# Altium schematic sheet peripherals.SchDoc
size 420 x 297 mm
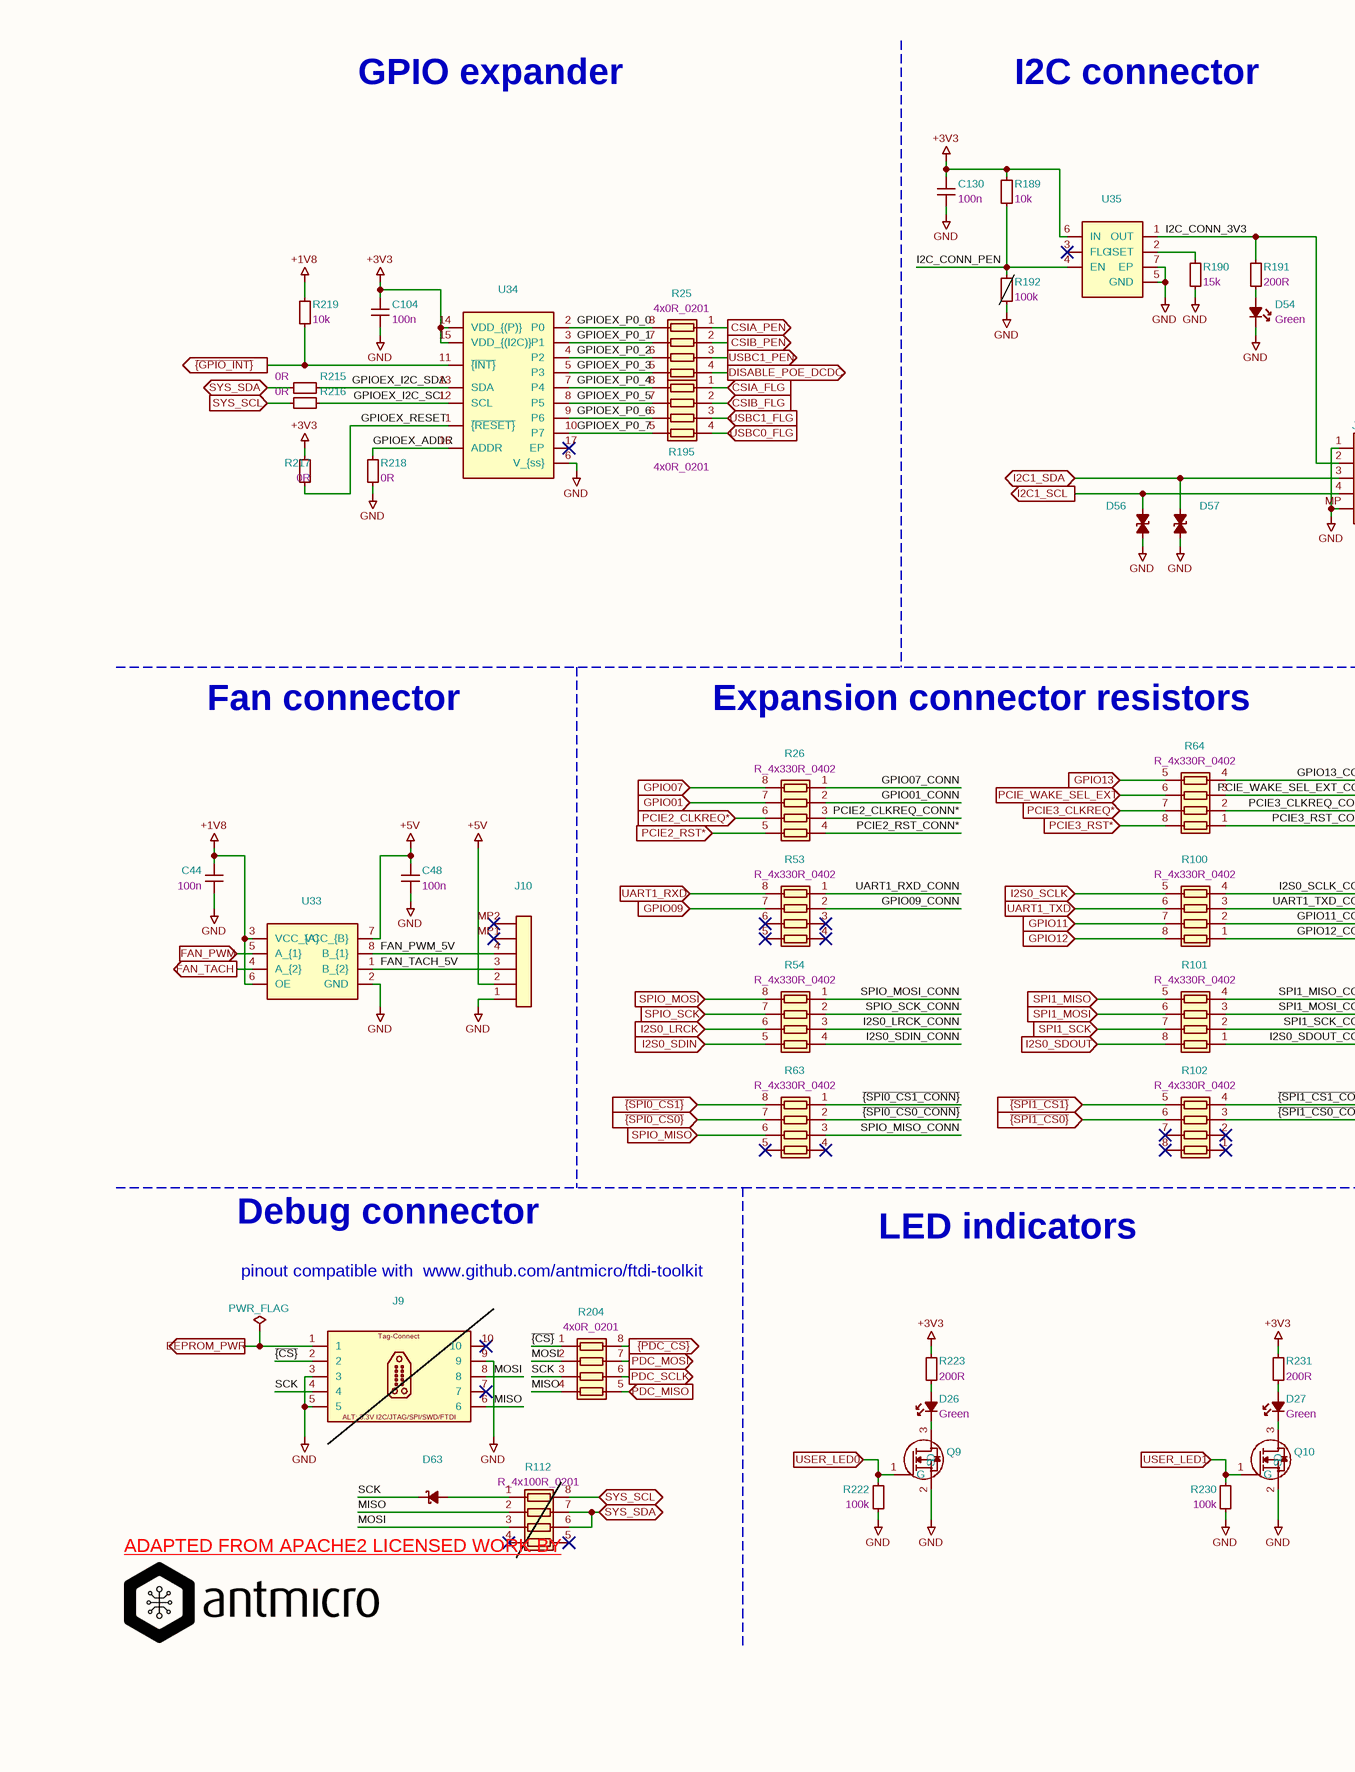
[diagram p0: peripherals.SchDoc, left]
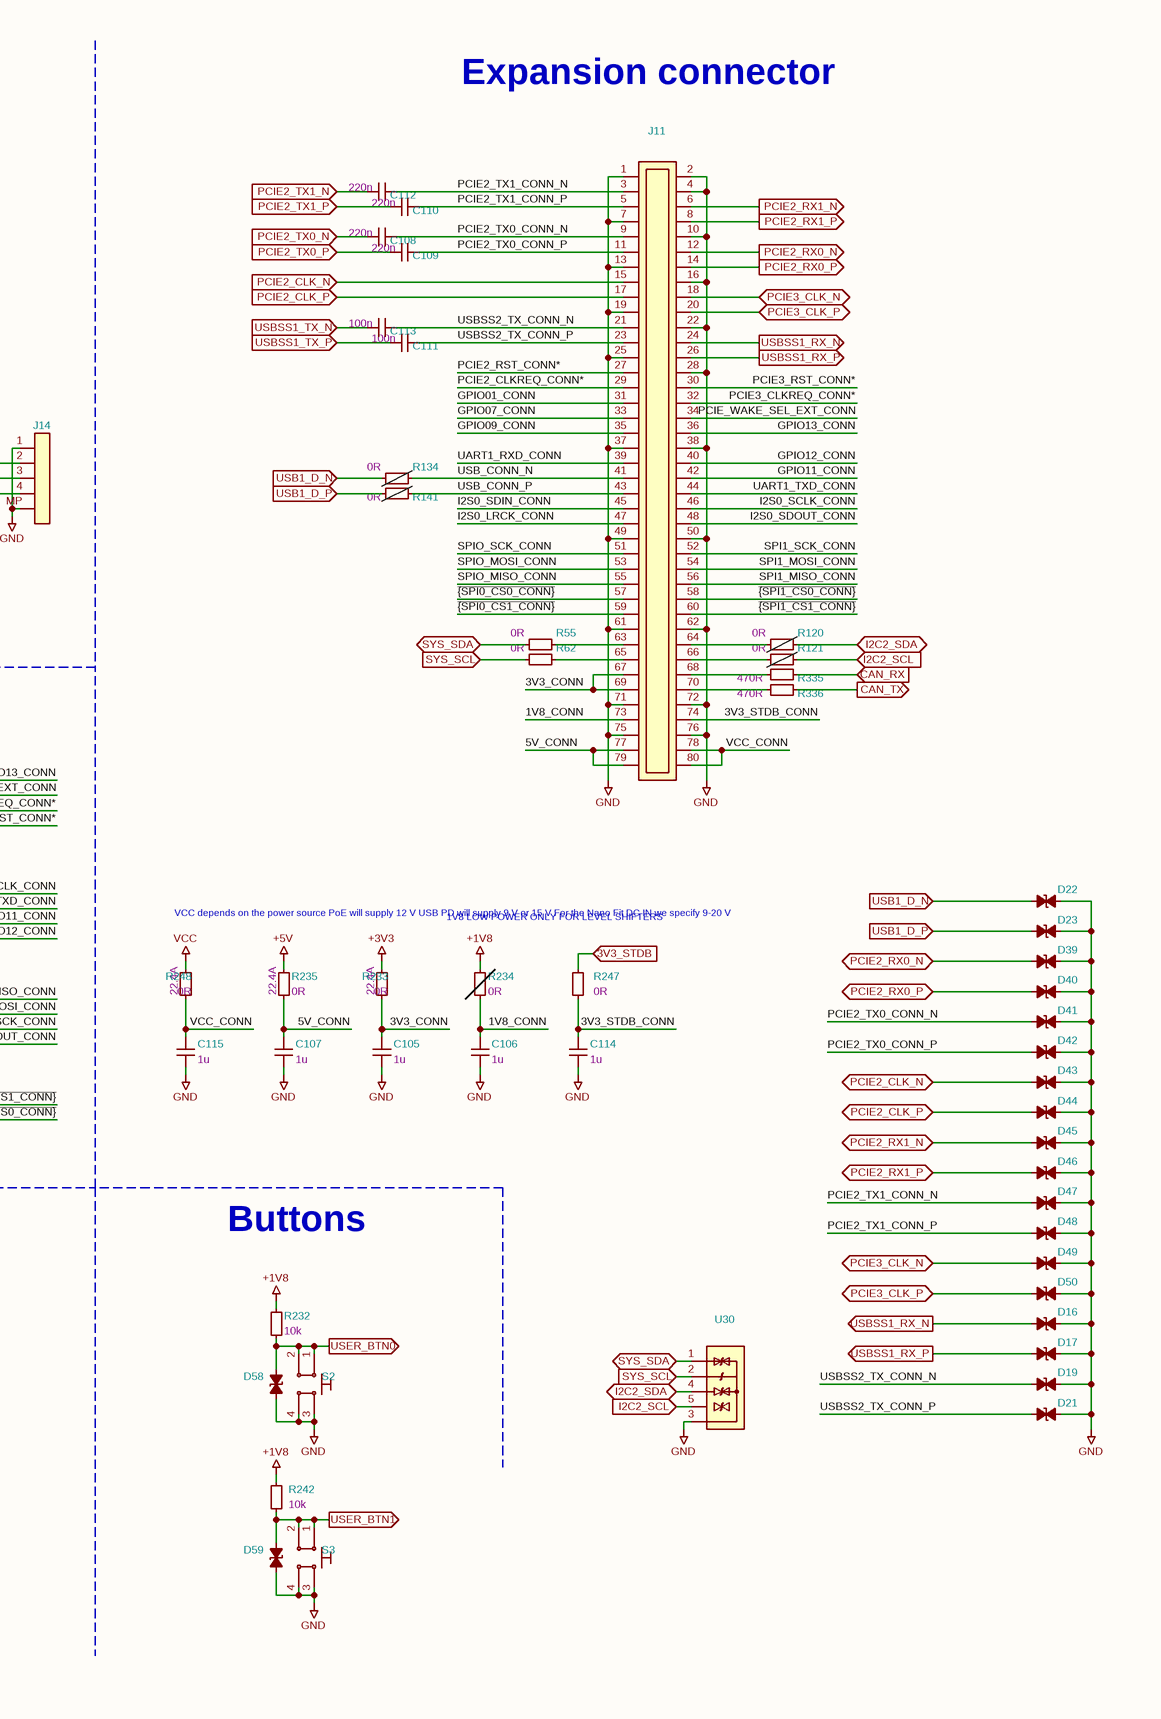
[diagram p1: peripherals.SchDoc, right]

## Parts
#FLG07  PWR_FLAG  (graphical)
C44  Val: 100n  [C_0402_1005Metric]  (hidden comment: GRM155R61H104KE14D)
C48  Val: 100n  [C_0402_1005Metric]  (hidden comment: GRM155R61H104KE14D)
C104  Val: 100n  [C_0402_1005Metric]  (hidden comment: GRM155R61H104KE14D)
C105  Val: 1u  [C_0402_1005Metric]  (hidden comment: C1005X6S1A105K050BC)
C106  Val: 1u  [C_0402_1005Metric]  (hidden comment: C1005X6S1A105K050BC)
C107  Val: 1u  [C_0402_1005Metric]  (hidden comment: C1005X6S1A105K050BC)
C108  Val: 220n  [C_0402_1005Metric]  (hidden comment: CC0402KRX5R6BB224)
C109  Val: 220n  [C_0402_1005Metric]  (hidden comment: CC0402KRX5R6BB224)
C110  Val: 220n  [C_0402_1005Metric]  (hidden comment: CC0402KRX5R6BB224)
C111  Val: 100n  [C_0402_1005Metric]  (hidden comment: GRM155R61H104KE14D)
C112  Val: 220n  [C_0402_1005Metric]  (hidden comment: CC0402KRX5R6BB224)
C113  Val: 100n  [C_0402_1005Metric]  (hidden comment: GRM155R61H104KE14D)
C114  Val: 1u  [C_0402_1005Metric]  (hidden comment: C1005X6S1A105K050BC)
C115  Val: 1u  [C_0402_1005Metric]  (hidden comment: C1005X6S1A105K050BC)
C130  Val: 100n  [C_0402_1005Metric]  (hidden comment: GRM155R61H104KE14D)
D16  TPD1E0B04DPYR  [XDFN-2_1x0.60mm]  (value not drawn)
D17  TPD1E0B04DPYR  [XDFN-2_1x0.60mm]  (value not drawn)
D19  TPD1E0B04DPYR  [XDFN-2_1x0.60mm]  (value not drawn)
D21  TPD1E0B04DPYR  [XDFN-2_1x0.60mm]  (value not drawn)
D22  TPD1E0B04DPYR  [XDFN-2_1x0.60mm]  (value not drawn)
D23  TPD1E0B04DPYR  [XDFN-2_1x0.60mm]  (value not drawn)
D26  Color: Green  [LED_0603_1608Metric_G]  (hidden comment: LTST-C190GKT)
D27  Color: Green  [LED_0603_1608Metric_G]  (hidden comment: LTST-C190GKT)
D39  TPD1E0B04DPYR  [XDFN-2_1x0.60mm]  (value not drawn)
D40  TPD1E0B04DPYR  [XDFN-2_1x0.60mm]  (value not drawn)
D41  TPD1E0B04DPYR  [XDFN-2_1x0.60mm]  (value not drawn)
D42  TPD1E0B04DPYR  [XDFN-2_1x0.60mm]  (value not drawn)
D43  TPD1E0B04DPYR  [XDFN-2_1x0.60mm]  (value not drawn)
D44  TPD1E0B04DPYR  [XDFN-2_1x0.60mm]  (value not drawn)
D45  TPD1E0B04DPYR  [XDFN-2_1x0.60mm]  (value not drawn)
D46  TPD1E0B04DPYR  [XDFN-2_1x0.60mm]  (value not drawn)
D47  TPD1E0B04DPYR  [XDFN-2_1x0.60mm]  (value not drawn)
D48  TPD1E0B04DPYR  [XDFN-2_1x0.60mm]  (value not drawn)
D49  TPD1E0B04DPYR  [XDFN-2_1x0.60mm]  (value not drawn)
D50  TPD1E0B04DPYR  [XDFN-2_1x0.60mm]  (value not drawn)
D54  Color: Green  [LED_0603_1608Metric_G]  (hidden comment: LTST-C190GKT)
D56  TPD1E0B04DPYR  [XDFN-2_1x0.60mm]  (value not drawn)
D57  TPD1E0B04DPYR  [XDFN-2_1x0.60mm]  (value not drawn)
D58  TPD1E0B04DPYR  [XDFN-2_1x0.60mm]  (value not drawn)
D59  TPD1E0B04DPYR  [XDFN-2_1x0.60mm]  (value not drawn)
D63  RB521S30T1G  [SOD-523]  (value not drawn)
J9  TC2050-IDC-NL  [Tag-Connect_TC2050-IDC-NL_2x5_P1.27mm]  (value not drawn)  (no BOM)
J10  0533980471  [Conn_Molex_PicoBlade_1x4_0533980471]  (value not drawn)
J11  ERF8-040-05.0-L-DV-K-TR  [Conn_Socket_Samtec_ERF8_2x40_ERF8-040-05.0-L-DV-K-TR]  (value not drawn)
J14  SM04B-SRSS-TB(LF)(SN)  [Conn_JST_SH_1x4_SM04B-SRSS-TB-LF-SN]  (value not drawn)
Q9  PJE138K_R1_00001  [SOT-523]  (value not drawn)
Q10  PJE138K_R1_00001  [SOT-523]  (value not drawn)
R25  Val: 4x0R_0201  [R_Array_4x0201_Panasonic_EXB18V]  (hidden comment: EXB-18VR000X)
R26  Val: R_4x330R_0402  [R_Array_4x0402]  (hidden comment: EXB-28V331JX)
R53  Val: R_4x330R_0402  [R_Array_4x0402]  (hidden comment: EXB-28V331JX)
R54  Val: R_4x330R_0402  [R_Array_4x0402]  (hidden comment: EXB-28V331JX)
R55  Val: 0R  [R_0402_1005Metric]  (hidden comment: ERJ2GE0R00X)
R62  Val: 0R  [R_0402_1005Metric]  (hidden comment: ERJ2GE0R00X)
R63  Val: R_4x330R_0402  [R_Array_4x0402]  (hidden comment: EXB-28V331JX)
R64  Val: R_4x330R_0402  [R_Array_4x0402]  (hidden comment: EXB-28V331JX)
R100  Val: R_4x330R_0402  [R_Array_4x0402]  (hidden comment: EXB-28V331JX)
R101  Val: R_4x330R_0402  [R_Array_4x0402]  (hidden comment: EXB-28V331JX)
R102  Val: R_4x330R_0402  [R_Array_4x0402]  (hidden comment: EXB-28V331JX)
R112  Val: R_4x100R_0201  [R_Array_4x0201_Panasonic_EXB18V]  (hidden comment: EXB-18V101JX)  (no BOM)
R120  Val: 0R  [R_0402_1005Metric]  (hidden comment: ERJ2GE0R00X)  (no BOM)
R121  Val: 0R  [R_0402_1005Metric]  (hidden comment: ERJ2GE0R00X)  (no BOM)
R134  Val: 0R  [R_0402_1005Metric]  (hidden comment: ERJ2GE0R00X)  (no BOM)
R141  Val: 0R  [R_0402_1005Metric]  (hidden comment: ERJ2GE0R00X)  (no BOM)
R189  Val: 10k  [R_0402_1005Metric]  (hidden comment: CR0402-FX-1002GLF)
R190  Val: 15k  [R_0402_1005Metric]  (hidden comment: CR0402-FX-1502GLF)
R191  Val: 200R  [R_0402_1005Metric]  (hidden comment: CR0402-FX-2000GLF)
R192  Val: 100k  [R_0402_1005Metric]  (hidden comment: CR0402-FX-1003GLF)  (no BOM)
R195  Val: 4x0R_0201  [R_Array_4x0201_Panasonic_EXB18V]  (hidden comment: EXB-18VR000X)
R204  Val: 4x0R_0201  [R_Array_4x0201_Panasonic_EXB18V]  (hidden comment: EXB-18VR000X)
R215  Val: 0R  [R_0402_1005Metric]  (hidden comment: ERJ2GE0R00X)
R216  Val: 0R  [R_0402_1005Metric]  (hidden comment: ERJ2GE0R00X)
R217  Val: 0R  [R_0402_1005Metric]  (hidden comment: ERJ2GE0R00X)
R218  Val: 0R  [R_0402_1005Metric]  (hidden comment: ERJ2GE0R00X)
R219  Val: 10k  [R_0402_1005Metric]  (hidden comment: CR0402-FX-1002GLF)
R222  Val: 100k  [R_0402_1005Metric]  (hidden comment: CR0402-FX-1003GLF)
R223  Val: 200R  [R_0402_1005Metric]  (hidden comment: CR0402-FX-2000GLF)
R230  Val: 100k  [R_0402_1005Metric]  (hidden comment: CR0402-FX-1003GLF)
R231  Val: 200R  [R_0402_1005Metric]  (hidden comment: CR0402-FX-2000GLF)
R232  Val: 10k  [R_0402_1005Metric]  (hidden comment: CR0402-FX-1002GLF)
R233  Val: 0R  Max. Curr.: 22.4A  [R_0603_1608Metric]  (hidden comment: PMR03EZPJ000)
R234  Val: 0R  [R_0603_1608Metric]  (hidden comment: CR0603-J/-000ELF)  (no BOM)
R235  Val: 0R  Max. Curr.: 22.4A  [R_0603_1608Metric]  (hidden comment: PMR03EZPJ000)
R242  Val: 10k  [R_0402_1005Metric]  (hidden comment: CR0402-FX-1002GLF)
R247  Val: 0R  [R_0603_1608Metric]  (hidden comment: CR0603-J/-000ELF)
R248  Val: 0R  Max. Curr.: 22.4A  [R_0603_1608Metric]  (hidden comment: PMR03EZPJ000)
R335  Val: 470R  [R_0402_1005Metric]  (hidden comment: CR0402-FX-4700GLF)
R336  Val: 470R  [R_0402_1005Metric]  (hidden comment: CR0402-FX-4700GLF)
S2  KMR211NGLFS  [SW_KMR211NGLFS_SMD]  (value not drawn)
S3  KMR211NGLFS  [SW_KMR211NGLFS_SMD]  (value not drawn)
U30  TPD4E05U06QDQARQ1  [USON-10_2.5x1mm_P0.5mm]  (value not drawn)
U33  NTS0102GT  [XSON-8_1x1.95mm_P0.5mm]  (value not drawn)
U34  PCAL6408ABSHP  [VQFN-16-1EP_3x3mm_P0.5mm_EP1.68x1.68mm]  (value not drawn)
U35  AP22653FDZ-7  [DFN-6-1EP_2x2mm_P0.65mm_EP1x1.6mm]  (value not drawn)

## Ports
3V3_STDB (in), CAN_RX (in), CAN_TX (out), CSIA_FLG (in), CSIA_PEN (out), CSIB_FLG (in), CSIB_PEN (out), DISABLE_POE_DCDC (out), EEPROM_PWR (out), FAN_PWM (in), FAN_TACH (out), GPIO01 (in), GPIO07 (in), GPIO09 (in), GPIO11 (in), GPIO12 (in), GPIO13 (in), I2C1_SCL (out), I2C1_SDA (bidir), I2C2_SCL (in), I2C2_SDA (bidir), I2S0_LRCK (in), I2S0_SCLK (in), I2S0_SDIN (in), I2S0_SDOUT (in), PCIE2_CLK_N (bidir), PCIE2_CLK_N (in), PCIE2_CLK_P (bidir), PCIE2_CLK_P (in), PCIE2_CLKREQ* (in), PCIE2_RST* (in), PCIE2_RX0_N (bidir), PCIE2_RX0_N (out), PCIE2_RX0_P (bidir), PCIE2_RX0_P (out), PCIE2_RX1_N (bidir), PCIE2_RX1_N (out), PCIE2_RX1_P (bidir), PCIE2_RX1_P (out), PCIE2_TX0_N (in), PCIE2_TX0_P (in), PCIE2_TX1_N (in), PCIE2_TX1_P (in), PCIE3_CLK_N (bidir), PCIE3_CLK_P (bidir), PCIE3_CLKREQ* (in), PCIE3_RST* (in), PCIE_WAKE_SEL_EXT (in), PDC_MISO (in), PDC_MOSI (out), PDC_SCLK (out), SPI1_MISO (in), SPI1_MOSI (in), SPI1_SCK (in), SPIO_MISO (in), SPIO_MOSI (in), SPIO_SCK (in), SYS_SCL (bidir), SYS_SCL (in), SYS_SDA (bidir), UART1_RXD (in), UART1_TXD (in), USB1_D_N (in), USB1_D_P (in), USBC0_FLG (in), USBC1_FLG (in), USBC1_PEN (out), USBSS1_RX_N (out), USBSS1_RX_P (out), USBSS1_TX_N (in), USBSS1_TX_P (in), USER_BTN0 (out), USER_BTN1 (out), USER_LED0 (in), USER_LED1 (in), ~{{GPIO_INT}} (out), ~{{PDC_CS}} (out), ~{{SPI0_CS0}} (in), ~{{SPI0_CS1}} (in), ~{{SPI1_CS0}} (in), ~{{SPI1_CS1}} (in)

## Nets
+1V8: C44.2 R219.2 R232.2 R234.1 R242.2 U33.3(VCC_{A}) U33.6(OE)
+3V3: C104.2 C130.1 R189.2 R217.1 R223.2 R231.2 R233.1 U34.14(VDD_{(P)}) U34.15(VDD_{(I2C)}) U35.6(IN)
+5V: C48.2 J10.2 R235.2 U33.7(VCC_{B})
GND: C44.1 C48.1 C104.1 C105.1 C106.1 C107.1 C114.2 C115.2 C130.2 D16.2(A) D17.2(A) D19.2(A) D21.2(A) D22.2(A) D23.2(A) D39.2(A) D40.2(A) D41.2(A) D42.2(A) D43.2(A) D44.2(A) D45.2(A) D46.2(A) D47.2(A) D48.2(A) D49.2(A) D50.2(A) D54.1(C) D56.1(C) D57.1(C) D58.1(C) D59.1(C) J9.3 J9.5 J9.9 J10.1 J11.1 J11.2 J11.4 J11.7 J11.10 J11.13 J11.16 J11.19 J11.22 J11.25 J11.28 J11.37 J11.38 J11.49 J11.50 J11.61 J11.62 J11.71 J11.72 J11.75 J11.76 J14.1 J14.MP Q9.2(S) Q10.2(S) R190.1 R192.1 R218.1 R222.1 R230.1 S2.3 S2.4 S3.3 S3.4 U30.3 U33.2(GND) U34.6(V_{ss}) U35.5(GND) U35.7(EP)
VCC: R248.1
1V8_CONN: C106.2 J11.73 R234.2
3V3_CONN: C105.2 J11.67 J11.69 R233.2
3V3_STDB: R247.2 ; port 3V3_STDB
3V3_STDB_CONN: C114.1 J11.74 R247.1
5V_CONN: C107.2 J11.77 J11.79 R235.1
CAN_RX: R335.1 ; port CAN_RX
CAN_TX: R336.1 ; port CAN_TX
CSIA_FLG: R195.1(R1.1) ; port CSIA_FLG
CSIA_PEN: R25.1(R1.1) ; port CSIA_PEN
CSIB_FLG: R195.2(R2.1) ; port CSIB_FLG
CSIB_PEN: R25.2(R2.1) ; port CSIB_PEN
DISABLE_POE_DCDC: R25.4(R4.1) ; port DISABLE_POE_DCDC
EEPROM_PWR: #FLG07.1(pwr) J9.1 ; port EEPROM_PWR
FAN_PWM: U33.5(A_{1}) ; port FAN_PWM
FAN_PWM_5V: J10.4 U33.8(B_{1})
FAN_TACH: U33.4(A_{2}) ; port FAN_TACH
FAN_TACH_5V: J10.3 U33.1(B_{2})
GPIO01: R26.7(R2.2) ; port GPIO01
GPIO01_CONN: J11.31 R26.2(R2.1)
GPIO07: R26.8(R1.2) ; port GPIO07
GPIO07_CONN: J11.33 R26.1(R1.1)
GPIO09: R53.7(R2.2) ; port GPIO09
GPIO09_CONN: J11.35 R53.2(R2.1)
GPIO11: R100.7(R2.2) ; port GPIO11
GPIO11_CONN: J11.42 R100.2(R2.1)
GPIO12: R100.8(R1.2) ; port GPIO12
GPIO12_CONN: J11.40 R100.1(R1.1)
GPIO13: R64.5(R4.2) ; port GPIO13
GPIO13_CONN: J11.36 R64.4(R4.1)
GPIOEX_ADDR: R218.2 U34.16(ADDR)
GPIOEX_I2C_SCL: R216.2 U34.12(SCL)
GPIOEX_I2C_SDA: R215.2 U34.13(SDA)
GPIOEX_P0_0: R25.8(R1.2) U34.2(P0)
GPIOEX_P0_1: R25.7(R2.2) U34.3(P1)
GPIOEX_P0_2: R25.6(R3.2) U34.4(P2)
GPIOEX_P0_3: R25.5(R4.2) U34.5(P3)
GPIOEX_P0_4: R195.8(R1.2) U34.7(P4)
GPIOEX_P0_5: R195.7(R2.2) U34.8(P5)
GPIOEX_P0_6: R195.6(R3.2) U34.9(P6)
GPIOEX_P0_7: R195.5(R4.2) U34.10(P7)
GPIOEX_RESET: R217.2 U34.1(~{{RESET}})
I2C1_SCL: D56.2(A) J14.4 ; port I2C1_SCL
I2C1_SDA: D57.2(A) J14.3 ; port I2C1_SDA
I2C2_SCL: R121.2 U30.5 ; port I2C2_SCL
I2C2_SDA: R120.2 U30.4 ; port I2C2_SDA
I2C_CONN_3V3: J14.2 R191.2 U35.1(OUT)
I2C_CONN_PEN: R189.1 R192.2 U35.4(EN)
I2S0_LRCK: R54.6(R3.2) ; port I2S0_LRCK
I2S0_LRCK_CONN: J11.47 R54.3(R3.1)
I2S0_SCLK: R100.5(R4.2) ; port I2S0_SCLK
I2S0_SCLK_CONN: J11.46 R100.4(R4.1)
I2S0_SDIN: R54.5(R4.2) ; port I2S0_SDIN
I2S0_SDIN_CONN: J11.45 R54.4(R4.1)
I2S0_SDOUT: R101.8(R1.2) ; port I2S0_SDOUT
I2S0_SDOUT_CONN: J11.48 R101.1(R1.1)
MISO: J9.6 R112.2(R2.1) R204.4(R4.1)
MOSI: J9.8 R112.3(R3.1) R204.2(R2.1)
PCIE2_CLK_N: D43.1(C) J11.15 ; port PCIE2_CLK_N
PCIE2_CLK_P: D44.1(C) J11.17 ; port PCIE2_CLK_P
PCIE2_CLKREQ*: R26.6(R3.2) ; port PCIE2_CLKREQ*
PCIE2_CLKREQ_CONN*: J11.29 R26.3(R3.1)
PCIE2_RST*: R26.5(R4.2) ; port PCIE2_RST*
PCIE2_RST_CONN*: J11.27 R26.4(R4.1)
PCIE2_RX0_N: D39.1(C) J11.12 ; port PCIE2_RX0_N
PCIE2_RX0_P: D40.1(C) J11.14 ; port PCIE2_RX0_P
PCIE2_RX1_N: D45.1(C) J11.6 ; port PCIE2_RX1_N
PCIE2_RX1_P: D46.1(C) J11.8 ; port PCIE2_RX1_P
PCIE2_TX0_CONN_N: C108.1 D41.1(C) J11.9
PCIE2_TX0_CONN_P: C109.1 D42.1(C) J11.11
PCIE2_TX0_N: C108.2 ; port PCIE2_TX0_N
PCIE2_TX0_P: C109.2 ; port PCIE2_TX0_P
PCIE2_TX1_CONN_N: C112.1 D47.1(C) J11.3
PCIE2_TX1_CONN_P: C110.1 D48.1(C) J11.5
PCIE2_TX1_N: C112.2 ; port PCIE2_TX1_N
PCIE2_TX1_P: C110.2 ; port PCIE2_TX1_P
PCIE3_CLK_N: D49.1(C) J11.18 ; port PCIE3_CLK_N
PCIE3_CLK_P: D50.1(C) J11.20 ; port PCIE3_CLK_P
PCIE3_CLKREQ*: R64.7(R2.2) ; port PCIE3_CLKREQ*
PCIE3_CLKREQ_CONN*: J11.32 R64.2(R2.1)
PCIE3_RST*: R64.8(R1.2) ; port PCIE3_RST*
PCIE3_RST_CONN*: J11.30 R64.1(R1.1)
PCIE_WAKE_SEL_EXT: R64.6(R3.2) ; port PCIE_WAKE_SEL_EXT
PCIE_WAKE_SEL_EXT_CONN: J11.34 R64.3(R3.1)
PDC_MISO: R204.5(R4.2) ; port PDC_MISO
PDC_MOSI: R204.7(R2.2) ; port PDC_MOSI
PDC_SCLK: R204.6(R3.2) ; port PDC_SCLK
SCK: D63.1(C) J9.4 R204.3(R3.1)
SPI1_MISO: R101.5(R4.2) ; port SPI1_MISO
SPI1_MISO_CONN: J11.56 R101.4(R4.1)
SPI1_MOSI: R101.6(R3.2) ; port SPI1_MOSI
SPI1_MOSI_CONN: J11.54 R101.3(R3.1)
SPI1_SCK: R101.7(R2.2) ; port SPI1_SCK
SPI1_SCK_CONN: J11.52 R101.2(R2.1)
SPIO_MISO: R63.6(R3.2) ; port SPIO_MISO
SPIO_MISO_CONN: J11.55 R63.3(R3.1)
SPIO_MOSI: R54.8(R1.2) ; port SPIO_MOSI
SPIO_MOSI_CONN: J11.53 R54.1(R1.1)
SPIO_SCK: R54.7(R2.2) ; port SPIO_SCK
SPIO_SCK_CONN: J11.51 R54.2(R2.1)
SYS_SCL: R62.1 R112.8(R1.2) R216.1 U30.2 ; port SYS_SCL
SYS_SDA: R55.1 R112.6(R3.2) R112.7(R2.2) R215.1 U30.1 ; port SYS_SDA
UART1_RXD: R53.8(R1.2) ; port UART1_RXD
UART1_RXD_CONN: J11.39 R53.1(R1.1)
UART1_TXD: R100.6(R3.2) ; port UART1_TXD
UART1_TXD_CONN: J11.44 R100.3(R3.1)
USB1_D_N: D22.1(C) R134.2 ; port USB1_D_N
USB1_D_P: D23.1(C) R141.2 ; port USB1_D_P
USB_CONN_N: J11.41 R134.1
USB_CONN_P: J11.43 R141.1
USBC0_FLG: R195.4(R4.1) ; port USBC0_FLG
USBC1_FLG: R195.3(R3.1) ; port USBC1_FLG
USBC1_PEN: R25.3(R3.1) ; port USBC1_PEN
USBSS1_RX_N: D16.1(C) J11.24 ; port USBSS1_RX_N
USBSS1_RX_P: D17.1(C) J11.26 ; port USBSS1_RX_P
USBSS1_TX_N: C113.2 ; port USBSS1_TX_N
USBSS1_TX_P: C111.2 ; port USBSS1_TX_P
USBSS2_TX_CONN_N: C113.1 D19.1(C) J11.21
USBSS2_TX_CONN_P: C111.1 D21.1(C) J11.23
USER_BTN0: D58.2(A) R232.1 S2.1 S2.2 ; port USER_BTN0
USER_BTN1: D59.2(A) R242.1 S3.1 S3.2 ; port USER_BTN1
USER_LED0: Q9.1(G) R222.2 ; port USER_LED0
USER_LED1: Q10.1(G) R230.2 ; port USER_LED1
VCC_CONN: C115.1 J11.78 J11.80 R248.2
~{{CS}}: J9.2 R204.1(R1.1)
~{{GPIO_INT}}: R219.1 U34.11(~{{INT}}) ; port ~{{GPIO_INT}}
~{{PDC_CS}}: R204.8(R1.2) ; port ~{{PDC_CS}}
~{{SPI0_CS0_CONN}}: J11.57 R63.2(R2.1)
~{{SPI0_CS0}}: R63.7(R2.2) ; port ~{{SPI0_CS0}}
~{{SPI0_CS1_CONN}}: J11.59 R63.1(R1.1)
~{{SPI0_CS1}}: R63.8(R1.2) ; port ~{{SPI0_CS1}}
~{{SPI1_CS0_CONN}}: J11.58 R102.3(R3.1)
~{{SPI1_CS0}}: R102.6(R3.2) ; port ~{{SPI1_CS0}}
~{{SPI1_CS1_CONN}}: J11.60 R102.4(R4.1)
~{{SPI1_CS1}}: R102.5(R4.2) ; port ~{{SPI1_CS1}}
NetD26_1: D26.1(C) Q9.3(D)
NetD26_2: D26.2(A) R223.1
NetD27_1: D27.1(C) Q10.3(D)
NetD27_2: D27.2(A) R231.1
NetD54_2: D54.2(A) R191.1
NetD63_2: D63.2(A) R112.1(R1.1)
NetJ11_63: J11.63 R55.2
NetJ11_64: J11.64 R120.1
NetJ11_65: J11.65 R62.2
NetJ11_66: J11.66 R121.1
NetJ11_68: J11.68 R335.2
NetJ11_70: J11.70 R336.2
NetR190_2: R190.2 U35.2(ISET)

Not connected (* = marked no-connect by the designer): J9 7* 10*; J10 MP1* MP2*; R53 3(R3.1)* 4(R4.1)* 5(R4.2)* 6(R3.2)*; R63 4(R4.1)* 5(R4.2)*; R102 1(R1.1)* 2(R2.1)* 7(R2.2)* 8(R1.2)*; R112 4(R4.1)* 5(R4.2)*; U30 6 7 8 9 10; U34 17(EP)*; U35 3(FLG)*

## Notes on the sheet
- GPIO expander
- I2C connector
- Expansion connector
- Fan connector
- Expansion connector resistors
- VCC depends on the power source
  PoE will supply 12 V
  USB PD will supply 9 V or 15 V
  For the Nano Fit DC IN we specify 9-20 V
- 1V8 LOW POWER
  ONLY FOR LEVEL
  SHIFTERS
- Debug connector
- pinout compatible with
  www.github.com/antmicro/ftdi-toolkit
- LED indicators
- Buttons
- ADAPTED FROM APACHE2 LICENSED WORK BY <https://github.com/antmicro/jetson-orin-baseboard>
- 1
- 2
- 3
- 4
- 5
- 6
- 7
- 8
- A
- B
- C
- D
- E
- www.antmicro.com <http://www.antmicro.com>
- Title: Jetson Orin Baseboard
- File: peripherals.kicad_sch
- Sheet: /
- Antmicro Ltd
- F
- KiCad E.D.A.  kicad (5.1.4)-1
- Size: A3
- Date: 2025-01-15
- Rev: 1.3.0
- Id: 1/1
- (in symbol Tag-Connect_TC2050-IDC-NL_2x5_P1.27mm_1) Tag-Connect; ALT: 3.3V I2C/JTAG/SPI/SWD/FTDI

## Library data of the parts
C44 C48 C104 C111 C113 C130 = C_100n_0402: Manufacturer 1: Murata; License: Apache-2.0; Voltage: 50V; Dielectric: X5R; Author: Antmicro; OldValue: C_100n_0402; Manufacturer Part Number 1: GRM155R61H104KE14D; Value: GRM155R61H104KE14D; Footprint: antmicro-footprints:C_0402_1005Metric
C105-C107 C114 C115 = C_1u_0402: Manufacturer 1: TDK; License: Apache-2.0; Author: Antmicro; OldValue: C_1u_0402; Manufacturer Part Number 1: C1005X6S1A105K050BC; Value: C1005X6S1A105K050BC; Footprint: antmicro-footprints:C_0402_1005Metric
C108-C110 C112 = C_220n_0402: Manufacturer 1: YAGEO; License: Apache-2.0; Author: Antmicro; OldValue: C_220n_0402; Manufacturer Part Number 1: CC0402KRX5R6BB224; Value: CC0402KRX5R6BB224; Footprint: antmicro-footprints:C_0402_1005Metric
D16 D17 D19 D21-D23 D39-D50 D56-D59 = TPD1E0B04_XDFN-2: Manufacturer 1: Texas Instruments; License: Apache-2.0; Author: Antmicro; OldValue: TPD1E0B04_XDFN-2; Manufacturer Part Number 1: TPD1E0B04DPYR; Value: TPD1E0B04DPYR; Footprint: antmicro-footprints:XDFN-2_1x0.60mm
D26 D27 D54 = LED_G_0603_LTST-C190GKT: Manufacturer 1: Lite-On; License: Apache-2.0; Author: Antmicro; OldValue: LED_G_0603_LTST-C190GKT; Manufacturer Part Number 1: LTST-C190GKT; Value: LTST-C190GKT; Footprint: antmicro-footprints:LED_0603_1608Metric_G
D63 = RB521S30T1G: Manufacturer 1: ON Semiconductor; License: Apache-2.0; Author: Antmicro; OldValue: RB521S30T1G; Manufacturer Part Number 1: RB521S30T1G; Value: RB521S30T1G; Footprint: antmicro-footprints:SOD-523
J9 = Tag-Connect_TC2050-IDC-NL_2x5_P1.27mm_1: Manufacturer 1: Tag Connect; License: Apache-2.0; Author: Antmicro; OldValue: Tag-Connect_TC2050-IDC-NL_2x5_P1.27mm; Manufacturer Part Number 1: TC2050-IDC-NL; Value: TC2050-IDC-NL; Footprint: antmicro-footprints:Tag-Connect_TC2050-IDC-NL_2x5_P1.27mm
J10 = Molex_PicoBlade_1x4_0533980471: Manufacturer 1: Molex; License: Apache-2.0; Author: Antmicro; OldValue: Molex_PicoBlade_1x4_0533980471; Manufacturer Part Number 1: 0533980471; Value: 0533980471; Footprint: antmicro-footprints:Conn_Molex_PicoBlade_1x4_0533980471
J11 = Socket_Samtec_ERF8_2x40_ERF8-040-05.0-L-DV-K-TR: Manufacturer 1: Samtec; License: Apache-2.0; Pitch: 0.8 mm; Author: Antmicro; OldValue: Socket_Samtec_ERF8_2x40_ERF8-040-05.0-L-DV-K-TR; Manufacturer Part Number 1: ERF8-040-05.0-L-DV-K-TR; Value: ERF8-040-05.0-L-DV-K-TR; Footprint: antmicro-footprints:Conn_Socket_Samtec_ERF8_2x40_ERF8-040-05.0-L-DV-K-TR
J14 = JST_SH_1x4_SM04B-SRSS-TB-LF-SN: Manufacturer 1: JST Automotive Connectors; License: Apache-2.0; Author: Antmicro; OldValue: JST_SH_1x4_SM04B-SRSS-TB-LF-SN; Manufacturer Part Number 1: SM04B-SRSS-TB(LF)(SN); Value: SM04B-SRSS-TB(LF)(SN); Footprint: antmicro-footprints:Conn_JST_SH_1x4_SM04B-SRSS-TB-LF-SN
Q9 Q10 = PJE138K: Manufacturer 1: PANJIT; License: Apache-2.0; Author: Antmicro; OldValue: PJE138K; Manufacturer Part Number 1: PJE138K_R1_00001; Value: PJE138K_R1_00001; Footprint: antmicro-footprints:SOT-523
R25 R195 R204 = R_4x0R_0201_array: Manufacturer 1: Panasonic; License: Apache-2.0; Author: Antmicro; OldValue: R_4x0R_0201_array; Manufacturer Part Number 1: EXB-18VR000X; Value: EXB-18VR000X; Footprint: antmicro-footprints:R_Array_4x0201_Panasonic_EXB18V
R26 R53 R54 R63 R64 R100-R102 = R_4x330R_0402_array: Manufacturer 1: Panasonic; License: Apache-2.0; Author: Antmicro; OldValue: R_4x330R_0402_array; Manufacturer Part Number 1: EXB-28V331JX; Value: EXB-28V331JX; Footprint: antmicro-footprints:R_Array_4x0402
R55 R62 R120 R121 R134 R141 R215-R218 = R_0R_0402: Manufacturer 1: Panasonic; License: Apache-2.0; Tolerance: ~; Current: 1A; Author: Antmicro; OldValue: R_0R_0402; Manufacturer Part Number 1: ERJ2GE0R00X; Value: ERJ2GE0R00X; Footprint: antmicro-footprints:R_0402_1005Metric
R112 = R_4x100R_0201_array: Manufacturer 1: Panasonic; License: Apache-2.0; Author: Antmicro; OldValue: R_4x100R_0201_array; Manufacturer Part Number 1: EXB-18V101JX; Value: EXB-18V101JX; Footprint: antmicro-footprints:R_Array_4x0201_Panasonic_EXB18V
R189 R219 R232 R242 = R_10k_0402: Manufacturer 1: Bourns; License: Apache-2.0; Tolerance: 1%; Author: Antmicro; OldValue: R_10k_0402; Manufacturer Part Number 1: CR0402-FX-1002GLF; Value: CR0402-FX-1002GLF; Footprint: antmicro-footprints:R_0402_1005Metric
R190 = R_15k_0402: Manufacturer 1: Bourns; License: Apache-2.0; Tolerance: 1%; Author: Antmicro; OldValue: R_15k_0402; Manufacturer Part Number 1: CR0402-FX-1502GLF; Value: CR0402-FX-1502GLF; Footprint: antmicro-footprints:R_0402_1005Metric
R191 R223 R231 = R_200R_0402: Manufacturer 1: Bourns; License: Apache-2.0; Tolerance: 1%; Author: Antmicro; OldValue: R_200R_0402; Manufacturer Part Number 1: CR0402-FX-2000GLF; Value: CR0402-FX-2000GLF; Footprint: antmicro-footprints:R_0402_1005Metric
R192 R222 R230 = R_100k_0402: Manufacturer 1: Bourns; License: Apache-2.0; Tolerance: 1%; Author: Antmicro; OldValue: R_100k_0402; Manufacturer Part Number 1: CR0402-FX-1003GLF; Value: CR0402-FX-1003GLF; Footprint: antmicro-footprints:R_0402_1005Metric
R233 R235 R248 = R_0R_22.4A_0603: Manufacturer 1: ROHM Semiconductor; License: Apache-2.0; Tolerance: template_tolerance; Author: Antmicro; OldValue: R_0R_22.4A_0603; Manufacturer Part Number 1: PMR03EZPJ000; Value: PMR03EZPJ000; Footprint: antmicro-footprints:R_0603_1608Metric
R234 R247 = R_0R_0603: Manufacturer 1: Bourns; License: Apache-2.0; Tolerance: ~; Current: 1A; Author: Antmicro; OldValue: R_0R_0603; Manufacturer Part Number 1: CR0603-J/-000ELF; Value: CR0603-J/-000ELF; Footprint: antmicro-footprints:R_0603_1608Metric
R335 R336 = R_470R_0402: Manufacturer 1: Bourns; License: Apache-2.0; Tolerance: 1%; Author: Antmicro; OldValue: R_470R_0402; Manufacturer Part Number 1: CR0402-FX-4700GLF; Value: CR0402-FX-4700GLF; Footprint: antmicro-footprints:R_0402_1005Metric
S2 S3 = SW_KMR211NGLFS_SMD: Manufacturer 1: C&K; License: Apache-2.0; Author: Antmicro; OldValue: SW_KMR211NGLFS_SMD; Manufacturer Part Number 1: KMR211NGLFS; Value: KMR211NGLFS; Footprint: antmicro-footprints:SW_KMR211NGLFS_SMD
U30 = TPD4E05U06QDQARQ1: Manufacturer 1: Texas Instruments; License: Apache-2.0; Author: Antmicro; OldValue: TPD4E05U06QDQARQ1; Manufacturer Part Number 1: TPD4E05U06QDQARQ1; Value: TPD4E05U06QDQARQ1; Footprint: antmicro-footprints:USON-10_2.5x1mm_P0.5mm
U33 = NTS0102_XSON: Manufacturer 1: NXP; License: Apache-2.0; Author: Antmicro; OldValue: NTS0102_XSON; Manufacturer Part Number 1: NTS0102GT; Value: NTS0102GT; Footprint: antmicro-footprints:XSON-8_1x1.95mm_P0.5mm
U34 = PCAL6408A_VQFN: Manufacturer 1: NXP; License: Apache-2.0; Author: Antmicro; OldValue: PCAL6408A_VQFN; Manufacturer Part Number 1: PCAL6408ABSHP; Value: PCAL6408ABSHP; Footprint: antmicro-footprints:VQFN-16-1EP_3x3mm_P0.5mm_EP1.68x1.68mm
U35 = AP22653_DFN: Manufacturer 1: Diodes Incorporated; License: Apache-2.0; Author: Antmicro; OldValue: AP22653_DFN; Manufacturer Part Number 1: AP22653FDZ-7; Value: AP22653FDZ-7; Footprint: antmicro-footprints:DFN-6-1EP_2x2mm_P0.65mm_EP1x1.6mm
#FLG07 = PWR_FLAG: Value: PWR_FLAG